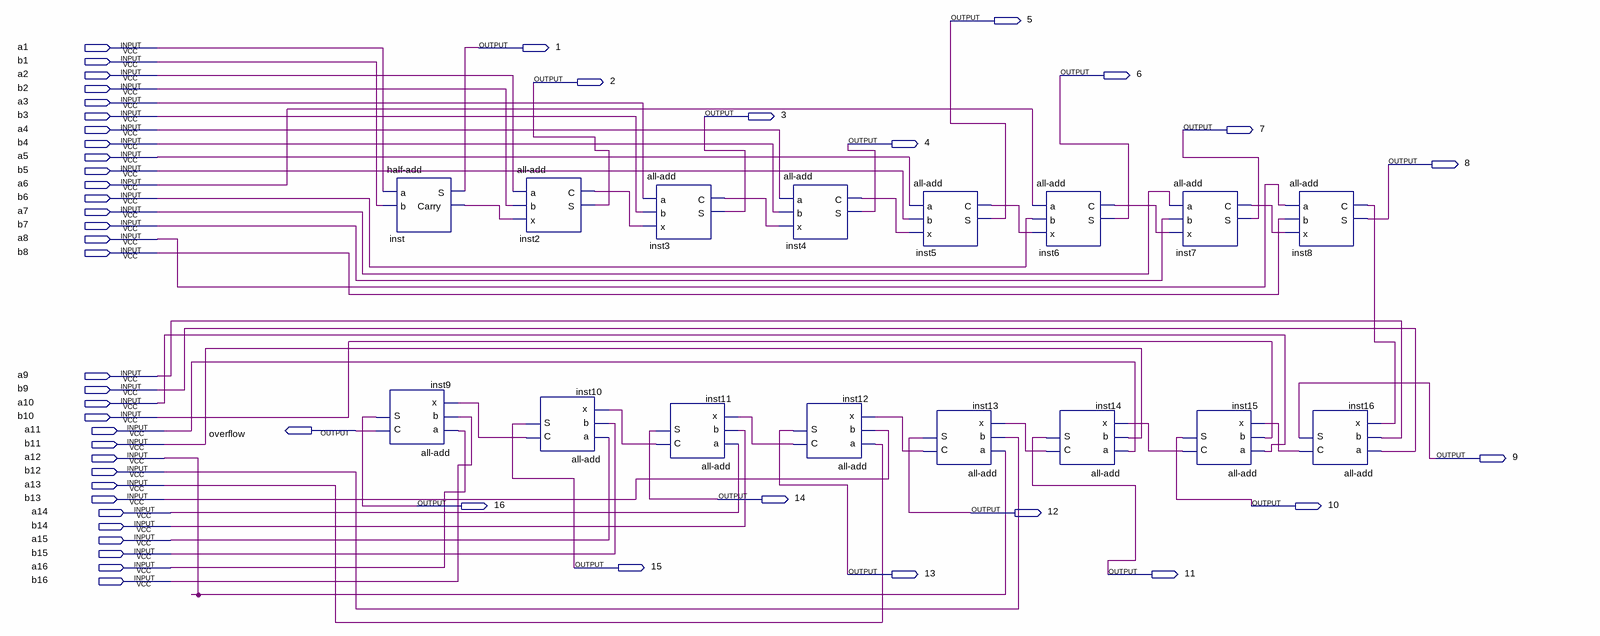
[diagram p0: schematic sheet]
// Quartus schematic 16bitadd.bdf as structural Verilog: 16 symbols, 49 pins
module \16bitadd  (
  input  a1,
  input  b1,
  input  a2,
  input  b2,
  input  a3,
  input  b3,
  input  a4,
  input  b4,
  input  a5,
  input  b5,
  input  a6,
  input  b6,
  input  a7,
  input  b7,
  input  a8,
  input  b8,
  input  a9,
  input  b9,
  input  a10,
  input  b10,
  input  a11,
  input  b11,
  input  a12,
  input  b12,
  input  a13,
  input  b13,
  input  a14,
  input  b14,
  input  a15,
  input  b15,
  input  a16,
  input  b16,
  output \5 ,
  output \1 ,
  output \6 ,
  output \2 ,
  output \3 ,
  output \7 ,
  output \4 ,
  output \8 ,
  output overflow,
  output \9 ,
  output \14 ,
  output \16 ,
  output \10 ,
  output \12 ,
  output \15 ,
  output \13 ,
  output \11 
);

  wire inst2_c, inst3_c, inst4_c, inst5_c, inst6_c, inst7_c, inst8_c, inst10_c, inst11_c, inst12_c, inst13_c,
       inst14_c, inst15_c, inst16_c, inst_carry;

  \half-add  inst (.a(a1), .b(b1), .S(\1 ), .Carry(inst_carry));
  \all-add  inst9 (.a(a16), .b(b16), .x(inst10_c), .C(overflow), .S(\16 ));
  \all-add  inst2 (.a(a2), .b(b2), .x(inst_carry), .C(inst2_c), .S(\2 ));
  \all-add  inst10 (.a(a15), .b(b15), .x(inst11_c), .C(inst10_c), .S(\15 ));
  \all-add  inst3 (.a(a3), .b(b3), .x(inst2_c), .C(inst3_c), .S(\3 ));
  \all-add  inst11 (.a(a14), .b(b14), .x(inst12_c), .C(inst11_c), .S(\14 ));
  \all-add  inst4 (.a(a4), .b(b4), .x(inst3_c), .C(inst4_c), .S(\4 ));
  \all-add  inst12 (.a(a13), .b(b13), .x(inst13_c), .C(inst12_c), .S(\13 ));
  \all-add  inst5 (.a(a5), .b(b5), .x(inst4_c), .C(inst5_c), .S(\5 ));
  \all-add  inst13 (.a(a12), .b(b12), .x(inst14_c), .C(inst13_c), .S(\12 ));
  \all-add  inst6 (.a(a6), .b(b6), .x(inst5_c), .C(inst6_c), .S(\6 ));
  \all-add  inst14 (.a(a11), .b(b11), .x(inst15_c), .C(inst14_c), .S(\11 ));
  \all-add  inst7 (.a(a7), .b(b7), .x(inst6_c), .C(inst7_c), .S(\7 ));
  \all-add  inst15 (.a(a10), .b(b10), .x(inst16_c), .C(inst15_c), .S(\10 ));
  \all-add  inst8 (.a(a8), .b(b8), .x(inst7_c), .C(inst8_c), .S(\8 ));
  \all-add  inst16 (.a(b9), .b(a9), .x(inst8_c), .C(inst16_c), .S(\9 ));
endmodule
